# Altium schematic sheet signalTable.SchDoc
size 127 x 127 mm
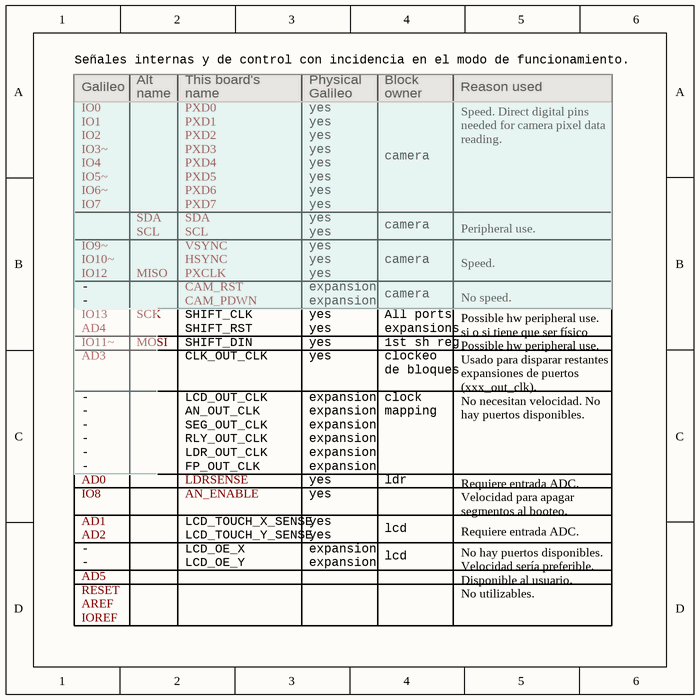
[diagram p0: signalTable.SchDoc]

## Notes on the sheet
- Señales internas y de control con incidencia en el modo de funcionamiento.
- Galileo
- Alt
- name
- This board's
- Physical
- Block
- owner
- Reason used
- yes
- camera
- Speed. Direct digital pins needed for camera pixel data reading.
- Peripheral use.
- -
- expansion
- Speed.
- No speed.
- SHIFT_DIN
- SHIFT_CLK
- SHIFT_RST
- CLK_OUT_CLK
- All ports
- expansions
- de bloques
- clockeo
- 1st sh reg
- Possible hw peripheral use.
- si o si tiene que ser físico
- LCD_OUT_CLK
- AN_OUT_CLK
- SEG_OUT_CLK
- RLY_OUT_CLK
- clock
- mapping
- Usado para disparar restantes expansiones de puertos (xxx_out_clk).
- No necesitan velocidad. No hay puertos disponibles.
- LDR_OUT_CLK
- FP_OUT_CLK
- ldr
- Requiere entrada ADC.
- Velocidad para apagar segmentos al booteo.
- LCD_TOUCH_X_SENSE
- LCD_TOUCH_Y_SENSE
- LCD_OE_X
- LCD_OE_Y
- lcd
- No hay puertos disponibles. Velocidad sería preferible.
- Disponible al usuario.
- No utilizables.
- Labels drawn without touching a wire or pin: AD0, AD1, AD2, AD3, AD4, AD5, AN_ENABLE, AREF, CAM_PDWN, CAM_RST, HSYNC, IO0, IO1, IO2, IO3~, IO4, IO5~, IO6~, IO7, IO8, IO9~, IO10~, IO11~, IO12, IO13, IOREF, LDRSENSE, MISO, MOSI, PXCLK, PXD0, PXD1, PXD2, PXD3, PXD4, PXD5, PXD6, PXD7, RESET, SCK, SCL, SDA, VSYNC